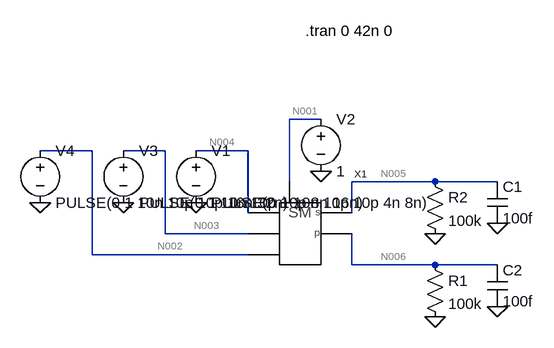
[diagram p0: schematic SUMTEST.asc]
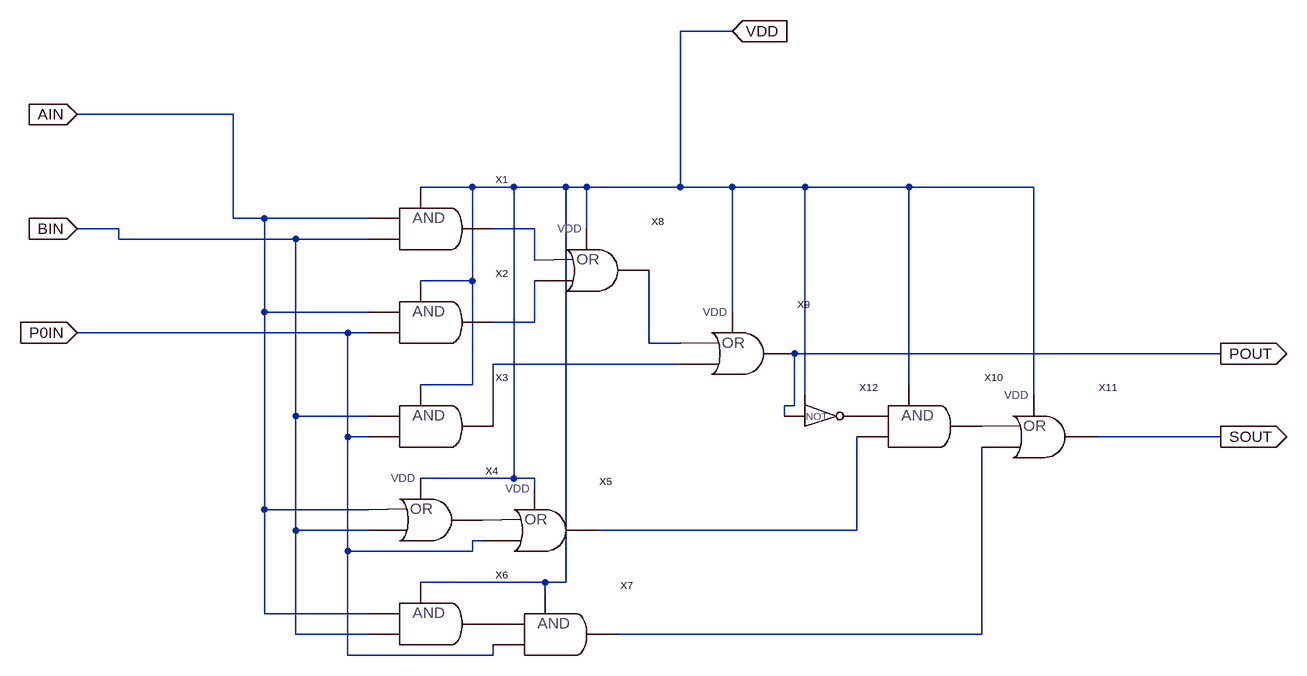
[diagram p1: sub-circuit sum.asc]
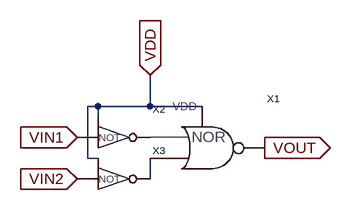
[diagram p2: sub-circuit and.asc]
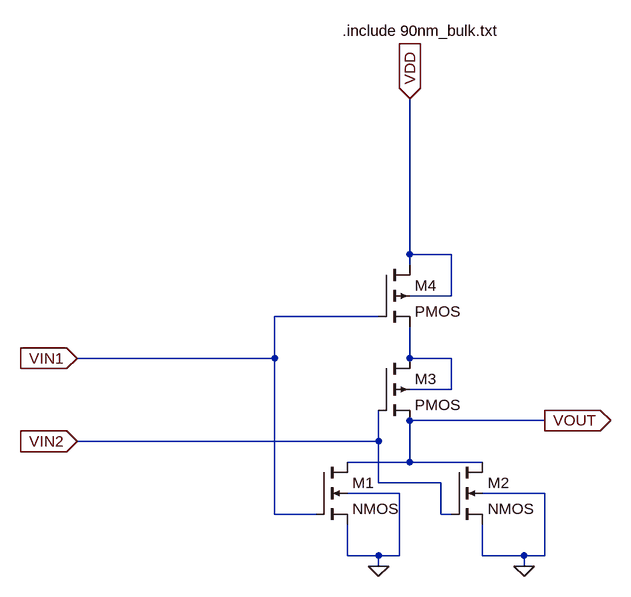
[diagram p3: sub-circuit nor.asc]
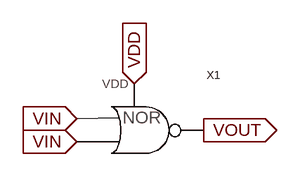
[diagram p4: sub-circuit not.asc]
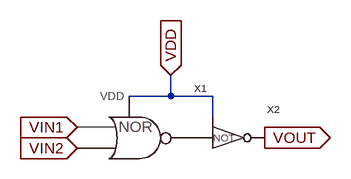
[diagram p5: sub-circuit or.asc]
SUMTEST.asc, the LTspice schematic file:
Version 4
SHEET 1 880 680
WIRE 272 16 224 16
WIRE -80 64 -160 64
WIRE 32 64 -32 64
WIRE 160 64 80 64
WIRE 224 112 224 16
WIRE 448 112 320 112
WIRE 544 112 448 112
WIRE 160 160 160 64
WIRE 320 160 320 112
WIRE 32 192 32 64
WIRE 160 192 32 192
WIRE -80 224 -80 64
WIRE 160 224 -80 224
WIRE 320 240 320 192
WIRE 448 240 320 240
WIRE 544 240 448 240
FLAG 80 144 0
FLAG -32 144 0
FLAG -160 144 0
FLAG 448 192 0
FLAG 544 176 0
FLAG 448 320 0
FLAG 544 304 0
FLAG 272 96 0
SYMBOL SUM 240 176 R0
SYMATTR InstName X1
SYMBOL voltage 80 48 R0
WINDOW 123 0 0 Left 0
WINDOW 39 0 0 Left 0
SYMATTR InstName V1
SYMATTR Value PULSE(0 1 10n 10p 10p 4n 8n)
SYMBOL voltage 272 0 R0
WINDOW 123 0 0 Left 0
WINDOW 39 0 0 Left 0
SYMATTR InstName V2
SYMATTR Value 1
SYMBOL voltage -32 48 R0
WINDOW 123 0 0 Left 0
WINDOW 39 0 0 Left 0
SYMATTR InstName V3
SYMATTR Value PULSE(0 1 10n 10p 10p 8n 16n)
SYMBOL voltage -160 48 R0
WINDOW 123 0 0 Left 0
WINDOW 39 0 0 Left 0
SYMATTR InstName V4
SYMATTR Value PULSE(0 1 10n 10p 10p 16n 32n)
SYMBOL res 432 224 R0
SYMATTR InstName R1
SYMATTR Value 100k
SYMBOL res 432 96 R0
SYMATTR InstName R2
SYMATTR Value 100k
SYMBOL cap 528 112 R0
SYMATTR InstName C1
SYMATTR Value 100f
SYMBOL cap 528 240 R0
SYMATTR InstName C2
SYMATTR Value 100f
TEXT 248 -120 Left 2 !.tran 0 42n 0

sum.asc, the sub-circuit schematic file:
Version 4
SHEET 1 1532 772
WIRE 656 -192 576 -192
WIRE -112 -64 -352 -64
WIRE 256 48 176 48
WIRE 320 48 256 48
WIRE 400 48 320 48
WIRE 432 48 400 48
WIRE 576 48 576 -192
WIRE 576 48 432 48
WIRE 656 48 576 48
WIRE 768 48 656 48
WIRE 928 48 768 48
WIRE 1120 48 928 48
WIRE -112 96 -112 -64
WIRE -64 96 -112 96
WIRE 96 96 -64 96
WIRE -288 112 -352 112
WIRE 352 112 288 112
WIRE 432 112 432 48
WIRE -288 128 -288 112
WIRE -16 128 -288 128
WIRE 96 128 -16 128
WIRE 352 160 352 112
WIRE 256 192 256 48
WIRE 256 192 176 192
WIRE -64 240 -64 96
WIRE 96 240 -64 240
WIRE 656 240 656 48
WIRE 352 256 352 192
WIRE 352 256 288 256
WIRE 64 272 -352 272
WIRE 96 272 64 272
WIRE 528 288 528 176
WIRE 576 288 528 288
WIRE 1408 304 752 304
WIRE 576 320 288 320
WIRE 256 352 256 192
WIRE 256 352 176 352
WIRE 928 352 928 48
WIRE 768 368 768 48
WIRE 1120 368 1120 48
WIRE 752 384 752 304
WIRE 752 384 736 384
WIRE -16 400 -16 128
WIRE 96 400 -16 400
WIRE 736 400 736 384
WIRE 288 416 288 320
WIRE 64 432 64 272
WIRE 96 432 64 432
WIRE 1408 432 1216 432
WIRE 320 496 320 48
WIRE 320 496 176 496
WIRE 352 496 320 496
WIRE 352 512 352 496
WIRE -64 544 -64 240
WIRE 96 544 -64 544
WIRE -16 576 -16 400
WIRE 96 576 -16 576
WIRE 848 576 848 432
WIRE 848 576 448 576
WIRE 272 592 256 592
WIRE 64 608 64 432
WIRE 256 608 256 592
WIRE 256 608 64 608
WIRE 368 656 176 656
WIRE 400 656 400 48
WIRE 400 656 368 656
WIRE 368 672 368 656
WIRE -64 704 -64 544
WIRE 96 704 -64 704
WIRE -16 736 -16 576
WIRE 96 736 -16 736
WIRE 1040 736 1040 448
WIRE 1040 736 480 736
WIRE 64 768 64 608
WIRE 288 768 288 752
WIRE 288 768 64 768
FLAG 1408 304 POUT
IOPIN 1408 304 Out
FLAG 1408 432 SOUT
IOPIN 1408 432 Out
FLAG 656 -192 VDD
IOPIN 656 -192 In
FLAG -352 -64 AIN
IOPIN -352 -64 In
FLAG -352 112 BIN
IOPIN -352 112 In
FLAG -352 272 P0IN
IOPIN -352 272 In
SYMBOL AND 176 112 R0
SYMATTR InstName X1
SYMBOL AND 176 256 R0
SYMATTR InstName X2
SYMBOL AND 176 416 R0
SYMATTR InstName X3
SYMBOL OR 176 560 R0
SYMATTR InstName X4
SYMBOL OR 352 576 R0
SYMATTR InstName X5
SYMBOL AND 176 720 R0
SYMATTR InstName X6
SYMBOL AND 368 736 R0
SYMATTR InstName X7
SYMBOL OR 432 176 R0
SYMATTR InstName X8
SYMBOL AND 928 416 R0
SYMATTR InstName X10
SYMBOL OR 1120 432 R0
SYMATTR InstName X11
SYMBOL OR 656 304 R0
SYMATTR InstName X9
SYMBOL NOT 800 400 R0
SYMATTR InstName X12

and.asc, the sub-circuit schematic file:
Version 4
SHEET 1 880 680
WIRE 48 96 32 96
WIRE 128 96 128 48
WIRE 128 96 48 96
WIRE 208 96 128 96
WIRE 48 112 48 96
WIRE 32 176 32 96
WIRE 48 176 32 176
WIRE 128 208 128 176
FLAG 16 144 VIN1
IOPIN 16 144 In
FLAG 16 208 VIN2
IOPIN 16 208 In
FLAG 128 48 VDD
IOPIN 128 48 In
FLAG 304 160 VOUT
IOPIN 304 160 Out
SYMBOL NOR 208 160 R0
SYMATTR InstName X1
SYMBOL NOT 80 144 R0
SYMATTR InstName X2
SYMBOL NOT 80 208 R0
SYMATTR InstName X3

nor.asc, the sub-circuit schematic file:
Version 4
SHEET 1 880 680
WIRE 336 -32 336 -272
WIRE 400 -32 336 -32
WIRE 336 -16 336 -32
WIRE 400 32 400 -32
WIRE 400 32 336 32
WIRE 288 64 128 64
WIRE 128 128 128 64
WIRE 128 128 -176 128
WIRE 336 128 336 80
WIRE 400 128 336 128
WIRE 400 176 400 128
WIRE 400 176 336 176
WIRE 336 224 336 208
WIRE 544 224 336 224
WIRE 288 256 288 208
WIRE 288 256 -176 256
WIRE 336 288 336 224
WIRE 336 288 240 288
WIRE 448 288 336 288
WIRE 288 320 288 256
WIRE 384 320 288 320
WIRE 320 336 240 336
WIRE 544 336 448 336
WIRE 128 368 128 128
WIRE 192 368 128 368
WIRE 384 368 384 320
WIRE 400 368 384 368
WIRE 240 432 240 384
WIRE 288 432 240 432
WIRE 320 432 320 336
WIRE 320 432 288 432
WIRE 448 432 448 384
WIRE 512 432 448 432
WIRE 544 432 544 336
WIRE 544 432 512 432
WIRE 288 448 288 432
WIRE 512 448 512 432
FLAG 288 448 0
FLAG 512 448 0
FLAG 544 224 VOUT
IOPIN 544 224 Out
FLAG -176 128 VIN1
IOPIN -176 128 In
FLAG -176 256 VIN2
IOPIN -176 256 In
FLAG 336 -272 VDD
IOPIN 336 -272 In
SYMBOL nmos4 192 288 R0
SYMATTR InstName M1
SYMATTR Value2 l=90n w=200n
SYMBOL nmos4 400 288 R0
SYMATTR InstName M2
SYMATTR Value2 l=90n w=200n
SYMBOL pmos4 288 128 R0
SYMATTR InstName M3
SYMATTR Value2 l=90n w=400n
SYMBOL pmos4 288 -16 R0
SYMATTR InstName M4
SYMATTR Value2 l=90n w=400n
TEXT 232 -376 Left 2 !.include 90nm_bulk.txt

not.asc, the sub-circuit schematic file:
Version 4
SHEET 1 880 680
FLAG 112 176 VIN
IOPIN 112 176 In
FLAG 112 208 VIN
IOPIN 112 208 In
FLAG 288 192 VOUT
IOPIN 288 192 Out
FLAG 192 128 VDD
IOPIN 192 128 In
SYMBOL NOR 192 192 R0
SYMATTR InstName X1

or.asc, the sub-circuit schematic file:
Version 4
SHEET 1 880 680
WIRE 256 96 256 64
WIRE 256 96 192 96
WIRE 320 96 256 96
WIRE 320 128 320 96
FLAG 112 144 VIN1
IOPIN 112 144 In
FLAG 112 176 VIN2
IOPIN 112 176 In
FLAG 256 64 VDD
IOPIN 256 64 In
FLAG 400 160 VOUT
IOPIN 400 160 Out
SYMBOL NOR 192 160 R0
SYMATTR InstName X1
SYMBOL NOT 352 160 R0
SYMATTR InstName X2

The netlist it stands for:
* SUMTEST.asc
XX1 N006 N005 N001 N004 N003 N002 sum
V1 N004 0 PULSE(0 1 10n 10p 10p 4n 8n)
V2 N001 0 1
V3 N003 0 PULSE(0 1 10n 10p 10p 8n 16n)
V4 N002 0 PULSE(0 1 10n 10p 10p 16n 32n)
R1 N006 0 100k
R2 N005 0 100k
C1 N005 0 100f
C2 N006 0 100f

* block symbol definitions
.subckt sum POUT SOUT VDD AIN BIN P0IN
XX1 VDD AIN BIN N001 and
XX2 VDD AIN P0IN N002 and
XX3 VDD BIN P0IN N004 and
XX4 AIN BIN VDD P001 or
XX5 P001 P0IN VDD N005 or
XX6 VDD AIN BIN P002 and
XX7 VDD P002 P0IN N006 and
XX8 N001 N002 VDD N003 or
XX10 VDD P003 N005 P004 and
XX11 P004 N006 VDD SOUT or
XX9 N003 N004 VDD POUT or
XX12 VDD POUT P003 not
.ends sum

.subckt and VDD VIN1 VIN2 VOUT
XX1 P001 N001 VDD VOUT nor
XX2 VDD VIN1 P001 not
XX3 VDD VIN2 N001 not
.ends and

.subckt nor VIN1 VIN2 VDD VOUT
M1 VOUT VIN1 0 0 NMOS l=90n w=200n
M2 VOUT VIN2 0 0 NMOS l=90n w=200n
M3 N001 VIN2 VOUT N001 PMOS l=90n w=400n
M4 VDD VIN1 N001 VDD PMOS l=90n w=400n
.include 90nm_bulk.txt
.ends nor

.subckt not VDD VIN VOUT
XX1 VIN VIN VDD VOUT nor
.ends not

.subckt or VIN1 VIN2 VDD VOUT
XX1 VIN1 VIN2 VDD P001 nor
XX2 VDD P001 VOUT not
.ends or

.model NMOS NMOS
.model PMOS PMOS
.lib standard.mos
.tran 0 42n 0
.backanno
.end

* Results of the author's LTspice run, read from the files saved beside the schematic
* Operating Point, zero values left out:
*   V(n001) = 1 V
*   V(n005) = 681 nV
*   V(n006) = 872.1 nV
*   I(R2) = 6.81 pA
*   I(R1) = 8.721 pA
*   I(V4) = 916 pA
*   I(V3) = 916 pA
*   I(V2) = -202.4 nA
*   I(V1) = 916 pA
*   Ix(x1:POUT) = -8.721 pA
*   Ix(x1:SOUT) = -6.81 pA
*   Ix(x1:VDD) = 202.4 nA
*   Ix(x1:AIN) = -916 pA
*   Ix(x1:BIN) = -916 pA
*   Ix(x1:P0IN) = -916 pA
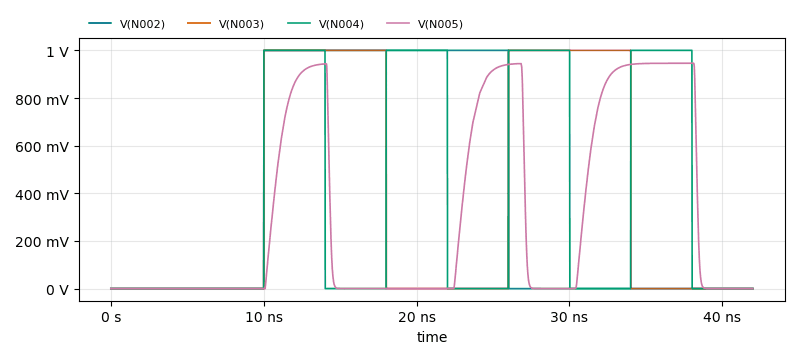
[diagram p6: Transient Analysis of SUMTEST.asc, plotted from the saved traces]
* Transient Analysis, 1 run:
*   V(N002): min 0 V, max 1 V, average 381.2 mV, rms 617.3 mV, last 0 V
*   V(N003): min 0 V, max 1 V, average 381.4 mV, rms 617.5 mV, last 0 V
*   V(N004): min 0 V, max 1 V, average 381.9 mV, rms 617.8 mV, last 0 V
*   V(N005): min -970.5 µV, max 946 mV, average 316.6 mV, rms 520.4 mV, last 529.5 nV